# Altium project 05_01 Lilypad.PrjPCB
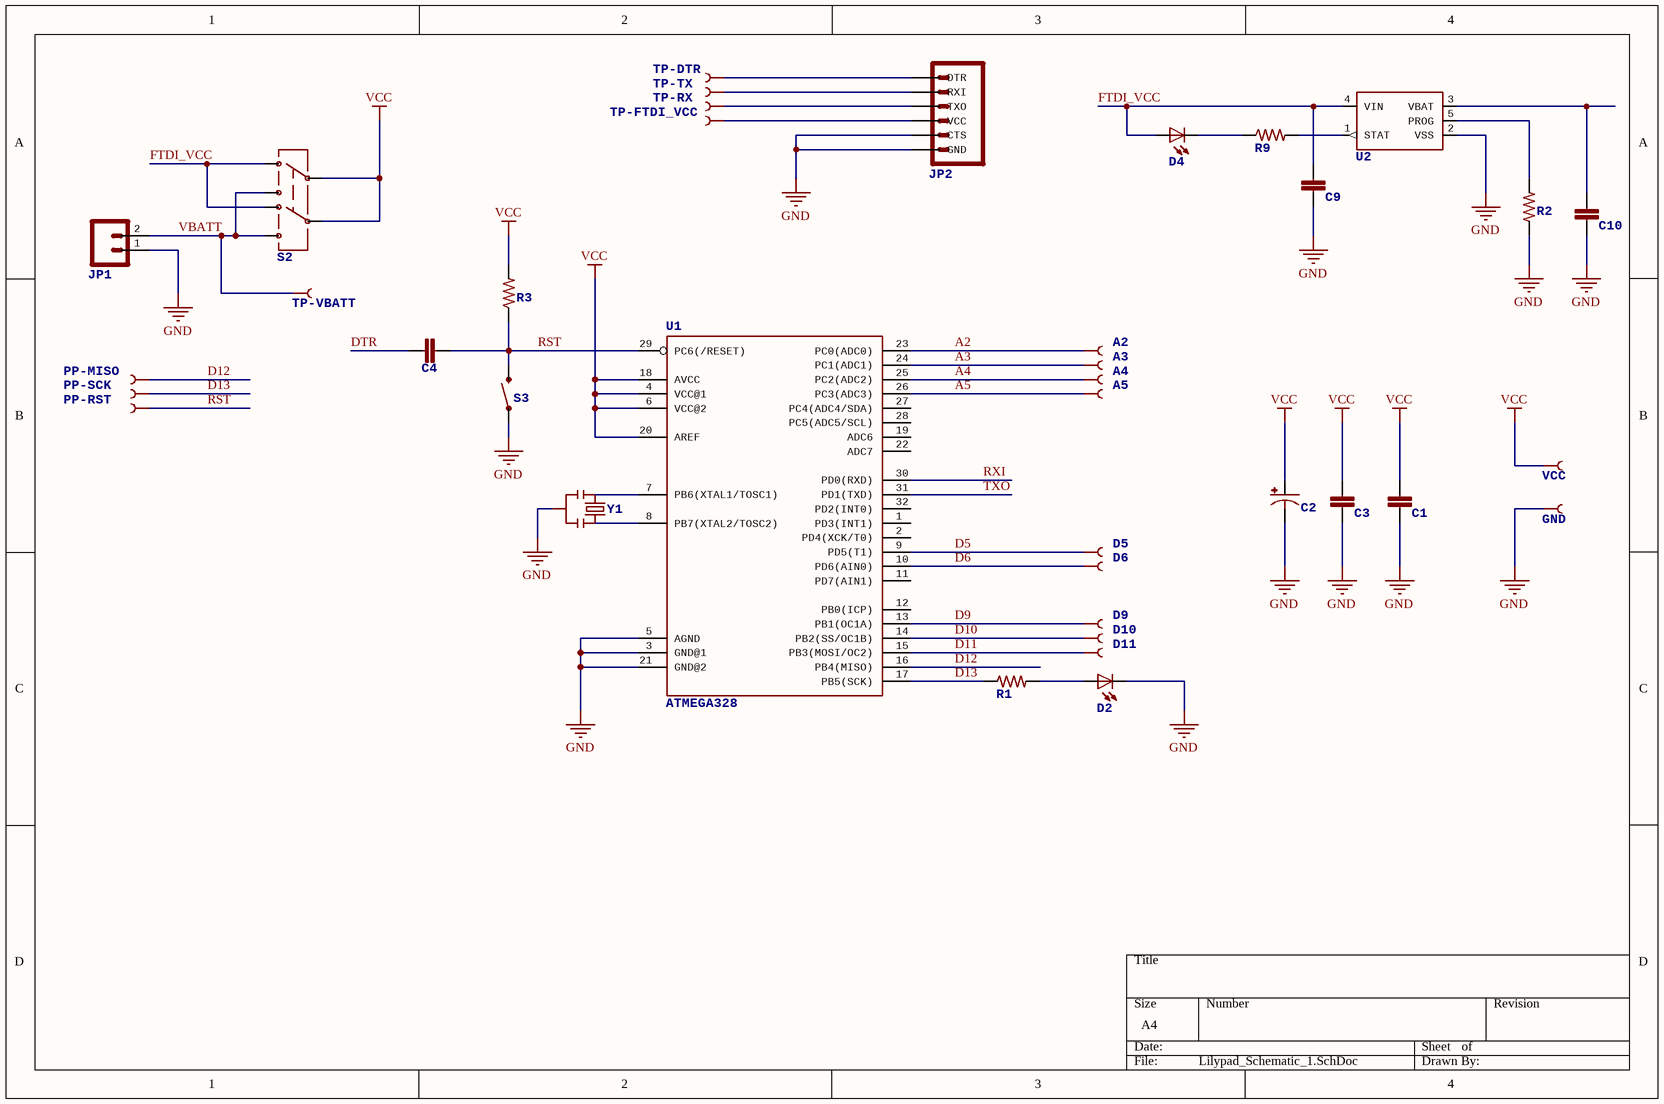
[diagram p0: Lilypad_Schematic_1.SchDoc]
1 sheet, 38 parts. Net scope: global (net labels, ports and power ports of the same name join across sheets).
Board file: Lilypad_PCB1.PcbDoc

## Sheet Lilypad_Schematic_1.SchDoc
size A4

### Parts
A2  CONN  [PETAL-LONG-2]  (value not drawn)
A3  CONN  [PETAL-LONG-2]  (value not drawn)
A4  CONN  [PETAL-LONG-2]  (value not drawn)
A5  CONN  [PETAL-LONG-2]  (value not drawn)
C1  CAP0402-CAP  [0402-CAP]  (value not drawn)
C2  CAP_POL3528  [EIA3528]  (value not drawn)
C3  CAP0402-CAP  [0402-CAP]  (value not drawn)
C4  CAP0402-CAP  [0402-CAP]  (value not drawn)
C9  CAP0402-CAP  [0402-CAP]  (value not drawn)
C10  CAP0402-CAP  [0402-CAP]  (value not drawn)
D2  LED0603  [LED-0603]  (value not drawn)
D4  LED0603  [LED-0603]  (value not drawn)
D5  CONN  [PETAL-LONG-2]  (value not drawn)
D6  CONN  [PETAL-LONG-2]  (value not drawn)
D9  CONN  [PETAL-LONG-2]  (value not drawn)
D10  CONN  [PETAL-LONG-2]  (value not drawn)
D11  CONN  [PETAL-LONG-2]  (value not drawn)
GND  CONN  [PETAL-LONG-2]  (value not drawn)
JP1  M02-JST-2MM-SMT  [JST-2-SMD]  (value not drawn)
JP2  ARDUINO_SERIAL_PROGRAMSMD  [1X06-SMD]  (value not drawn)
PP-MISO  TEST-POINT3X5  [PAD.03X.05]  (value not drawn)
PP-RST  TEST-POINT3X5  [PAD.03X.05]  (value not drawn)
PP-SCK  TEST-POINT3X5  [PAD.03X.05]  (value not drawn)
R1  RESISTOR0402-RES  [0402-RES]  (value not drawn)
R2  RESISTOR0402-RES  [0402-RES]  (value not drawn)
R3  RESISTOR0402-RES  [0402-RES]  (value not drawn)
R9  RESISTOR0402-RES  [0402-RES]  (value not drawn)
S2  AYZ0202  [AYZ0202]  (value not drawn)
S3  SWITCH-MOMENTARY-2SMD-2  [TACTILE_SWITCH_SMD-2]  (value not drawn)
TP-DTR  TEST-POINT3X5  [PAD.03X.05]  (value not drawn)
TP-FTDI_VCC  TEST-POINT3X5  [PAD.03X.05]  (value not drawn)
TP-RX  TEST-POINT3X5  [PAD.03X.05]  (value not drawn)
TP-TX  TEST-POINT3X5  [PAD.03X.05]  (value not drawn)
TP-VBATT  TEST-POINT3X5  [PAD.03X.05]  (value not drawn)
U1  ATMEGA328  [TQFP32-08]
U2  MCP73831  [SOT23-5]  (value not drawn)
VCC  CONN  [PETAL-LONG-2]  (value not drawn)
Y1  RESONATORSMD  [RESONATOR-SMD]  (value not drawn)

### Nets
GND: C1.2 C2.C(-) C3.2 C9.2 C10.2 D2.C GND.1 JP1.1 JP2.5(CTS) JP2.6(GND) R2.1 S3.2 U1.3(GND@1) U1.5(AGND) U1.21(GND@2) U2.2(VSS) Y1.2
VCC: C1.1 C2.A(+) C3.1 R3.2 S2.2 S2.5 U1.4(VCC@1) U1.6(VCC@2) U1.18(AVCC) U1.20(AREF) VCC.1
A2: A2.1 U1.23(PC0(ADC0))
A3: A3.1 U1.24(PC1(ADC1))
A4: A4.1 U1.25(PC2(ADC2))
A5: A5.1 U1.26(PC3(ADC3))
D5: D5.1 U1.9(PD5(T1))
D6: D6.1 U1.10(PD6(AIN0))
D9: D9.1 U1.13(PB1(OC1A))
D10: D10.1 U1.14(PB2(SS/OC1B))
D11: D11.1 U1.15(PB3(MOSI/OC2))
D12: PP-MISO.P$1 U1.16(PB4(MISO))
D13: PP-SCK.P$1 R1.1 U1.17(PB5(SCK))
DTR: C4.1
FTDI_VCC: C9.1 D4.A S2.3 S2.6 U2.4(VIN)
RST: C4.2 PP-RST.P$1 R3.1 S3.1 U1.29(PC6(/RESET))
RXI: U1.30(PD0(RXD))
TXO: U1.31(PD1(TXD))
VBATT: JP1.2 S2.1 S2.4 TP-VBATT.P$1
NetC10_1: C10.1 U2.3(VBAT)
NetD2_A: D2.A R1.2
NetD4_C: D4.C R9.1
NetJP2_1: JP2.1(DTR) TP-DTR.P$1
NetJP2_2: JP2.2(RXI) TP-TX.P$1
NetJP2_3: JP2.3(TXO) TP-RX.P$1
NetJP2_4: JP2.4(VCC) TP-FTDI_VCC.P$1
NetR2_2: R2.2 U2.5(PROG)
NetR9_2: R9.2 U2.1(STAT)
NetU1_7: U1.7(PB6(XTAL1/TOSC1)) Y1.1
NetU1_8: U1.8(PB7(XTAL2/TOSC2)) Y1.3

Not connected (* = marked no-connect by the designer): U1 1(PD3(INT1)) 2(PD4(XCK/T0)) 11(PD7(AIN1)) 12(PB0(ICP)) 19(ADC6) 22(ADC7) 27(PC4(ADC4/SDA)) 28(PC5(ADC5/SCL)) 32(PD2(INT0))